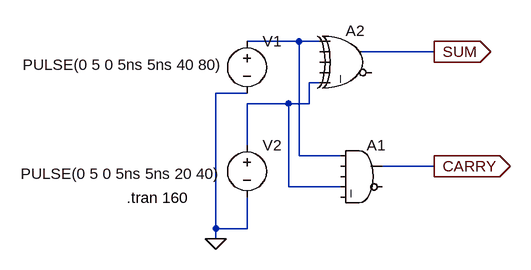
[diagram p0: schematic Half_Adder.asc]
Half_Adder.asc, the LTspice schematic file:
Version 4
SHEET 1 880 680
WIRE 64 48 -16 48
WIRE 96 48 64 48
WIRE 272 64 160 64
WIRE 96 112 80 112
WIRE -16 128 -64 128
WIRE 48 144 -16 144
WIRE 80 144 80 112
WIRE 80 144 48 144
WIRE -16 208 -16 144
WIRE 64 224 64 48
WIRE 128 224 64 224
WIRE 272 240 192 240
WIRE 48 272 48 144
WIRE 128 272 48 272
WIRE -64 336 -64 128
WIRE -16 336 -16 288
WIRE -16 336 -64 336
WIRE -64 352 -64 336
FLAG -64 352 0
FLAG 272 64 SUM
IOPIN 272 64 Out
FLAG 272 240 CARRY
IOPIN 272 240 Out
SYMBOL voltage -16 32 R0
WINDOW 3 -345 52 Left 2
WINDOW 123 0 0 Left 0
WINDOW 39 0 0 Left 0
SYMATTR InstName V1
SYMATTR Value PULSE(0 5 0 5ns 5ns 40 80)
SYMBOL voltage -16 192 R0
WINDOW 3 -348 60 Left 2
WINDOW 123 0 0 Left 0
WINDOW 39 0 0 Left 0
SYMATTR InstName V2
SYMATTR Value PULSE(0 5 0 5ns 5ns 20 40)
SYMBOL Digital\\and 160 192 R0
SYMATTR InstName A1
SYMBOL Digital\\xor 144 16 R0
SYMATTR InstName A2
TEXT -201 289 Left 2 !.tran 160

The netlist it stands for:
* Half_Adder.asc
V1 N001 0 PULSE(0 5 0 5ns 5ns 40 80)
V2 N002 0 PULSE(0 5 0 5ns 5ns 20 40)
A1 N001 0 0 N002 0 0 CARRY 0 AND
A2 N001 0 0 0 N002 0 SUM 0 XOR
.tran 160
.backanno
.end

* Results of the author's LTspice run, read from the files saved beside the schematic
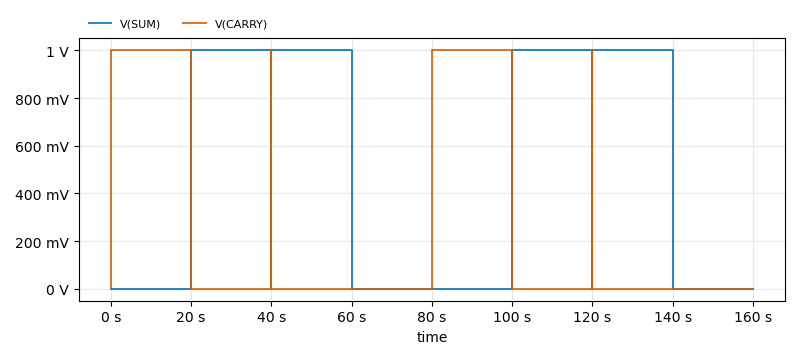
[diagram p1: Transient Analysis of Half_Adder.asc, plotted from the saved traces]
* Transient Analysis, 1 run:
*   V(SUM): min 0 V, max 1 V, average 500 mV, rms 707.1 mV, last 0 V
*   V(CARRY): min 0 V, max 1 V, average 250 mV, rms 500 mV, last 0 V